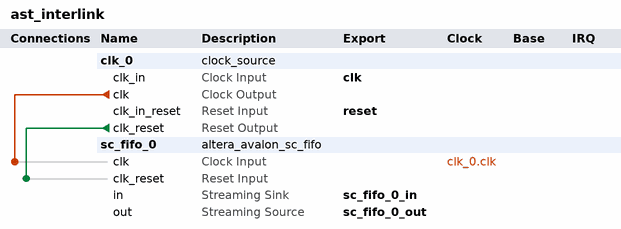
[diagram p0: system contents]
# Platform Designer (Qsys) system ast_interlink, Cyclone V 5CSXFC6D6F31I7
# Parameters at their usual value, and those the tool derives, are not listed.
package require -exact qsys 18.1
create_system ast_interlink
set_project_property DEVICE_FAMILY {Cyclone V}
set_project_property DEVICE 5CSXFC6D6F31I7

add_instance clk_0 clock_source 18.1
set_instance_parameter_value clk_0 clockFrequency 125000000

add_instance sc_fifo_0 altera_avalon_sc_fifo 18.1
set_instance_parameter_value sc_fifo_0 BITS_PER_SYMBOL 36
set_instance_parameter_value sc_fifo_0 CHANNEL_WIDTH 6
set_instance_parameter_value sc_fifo_0 ENABLE_EXPLICIT_MAXCHANNEL true
set_instance_parameter_value sc_fifo_0 ERROR_WIDTH 0
set_instance_parameter_value sc_fifo_0 EXPLICIT_MAXCHANNEL 40
set_instance_parameter_value sc_fifo_0 FIFO_DEPTH 64
set_instance_parameter_value sc_fifo_0 USE_FILL_LEVEL 1
set_instance_parameter_value sc_fifo_0 USE_MEMORY_BLOCKS 1
set_instance_parameter_value sc_fifo_0 USE_PACKETS 1
set_instance_parameter_value sc_fifo_0 USE_STORE_FORWARD 1

# connections
add_connection clk_0.clk sc_fifo_0.clk clock
add_connection clk_0.clk_reset sc_fifo_0.clk_reset reset

# exported interfaces
add_interface clk clock sink
set_interface_property clk EXPORT_OF clk_0.clk_in
add_interface reset reset sink
set_interface_property reset EXPORT_OF clk_0.clk_in_reset
add_interface sc_fifo_0_in avalon_streaming sink
set_interface_property sc_fifo_0_in EXPORT_OF sc_fifo_0.in
add_interface sc_fifo_0_out avalon_streaming source
set_interface_property sc_fifo_0_out EXPORT_OF sc_fifo_0.out

set_interconnect_requirement {$system} qsys_mm.clockCrossingAdapter HANDSHAKE
set_interconnect_requirement {$system} qsys_mm.enableEccProtection FALSE
set_interconnect_requirement {$system} qsys_mm.insertDefaultSlave FALSE
set_interconnect_requirement {$system} qsys_mm.maxAdditionalLatency 1

save_system ast_interlink.qsys
